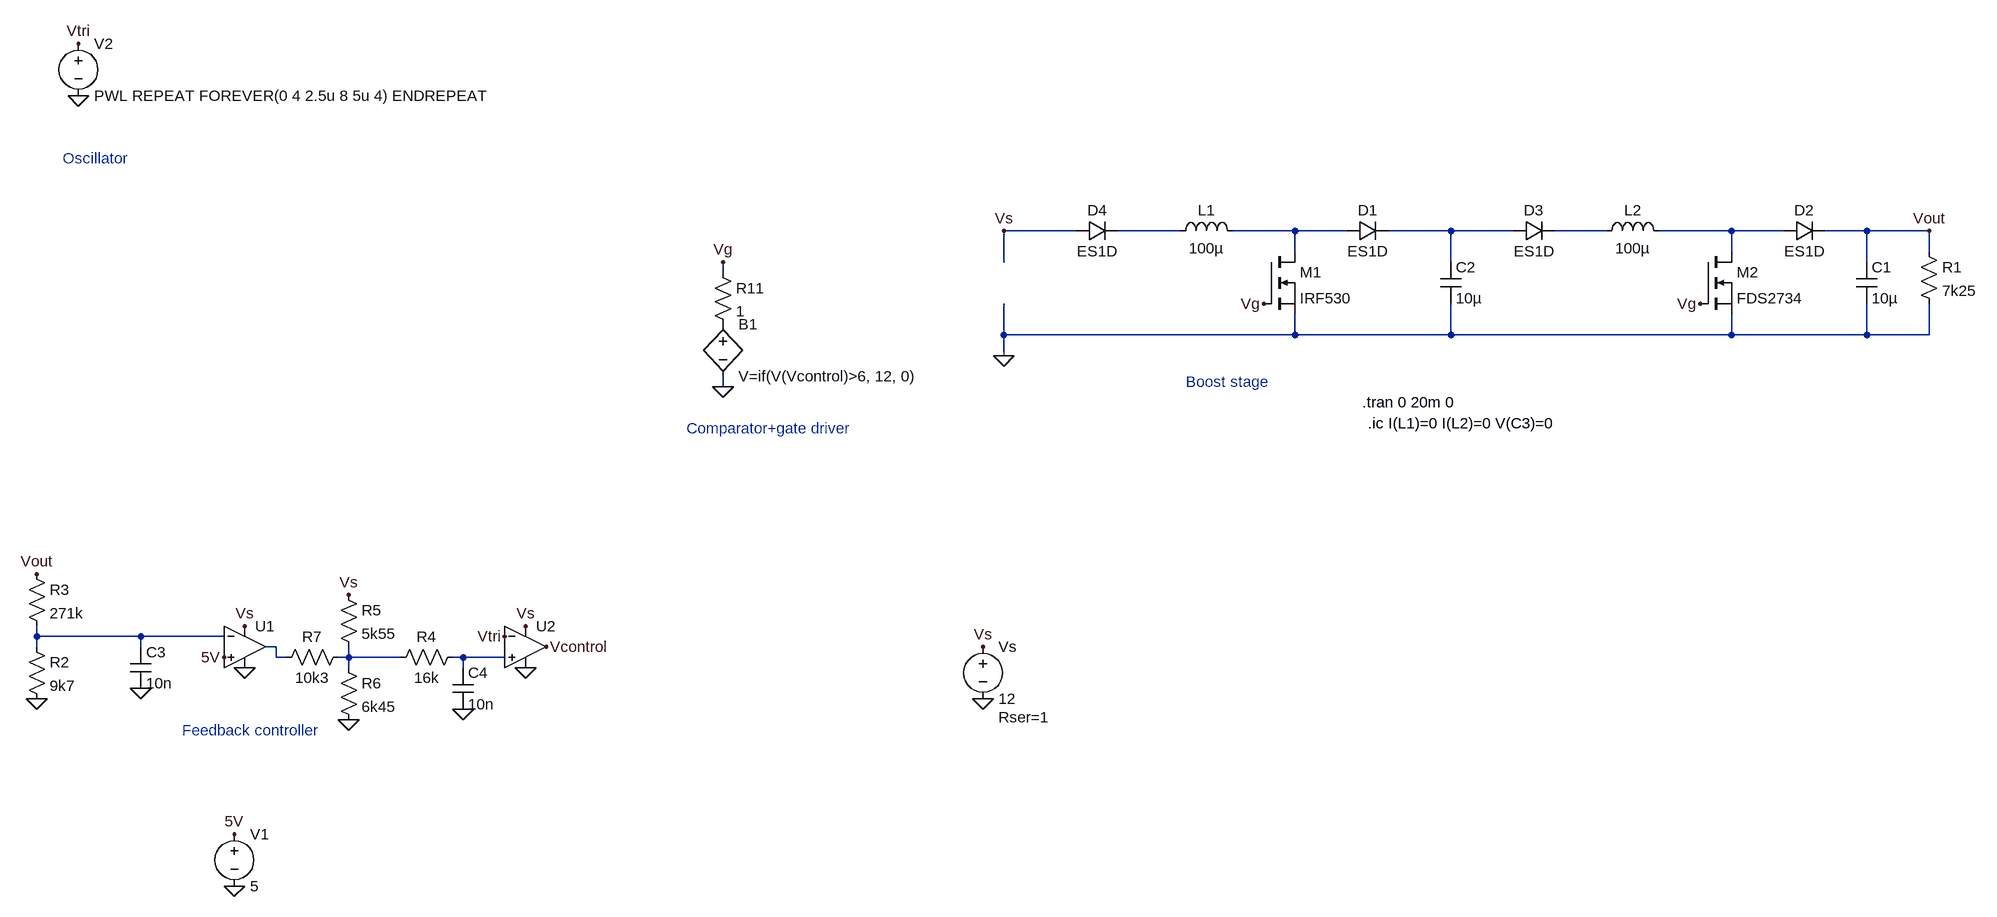
[diagram p0: schematic 2_stage_boost_converter.asc]
2_stage_boost_converter.asc, the LTspice schematic file:
Version 4
SHEET 1 1648 1172
WIRE 256 144 144 144
WIRE 416 144 320 144
WIRE 592 144 496 144
WIRE 672 144 592 144
WIRE 832 144 736 144
WIRE 928 144 832 144
WIRE 1072 144 992 144
WIRE 1264 144 1152 144
WIRE 1344 144 1264 144
WIRE 1472 144 1408 144
WIRE 1568 144 1472 144
WIRE 592 176 592 144
WIRE 1264 176 1264 144
WIRE 1568 176 1568 144
WIRE 144 192 144 144
WIRE 832 192 832 144
WIRE 1472 192 1472 144
WIRE -288 208 -288 192
WIRE 144 304 144 256
WIRE 592 304 592 272
WIRE 592 304 144 304
WIRE 832 304 832 256
WIRE 832 304 592 304
WIRE 1264 304 1264 272
WIRE 1264 304 832 304
WIRE 1472 304 1472 256
WIRE 1472 304 1264 304
WIRE 1568 304 1568 256
WIRE 1568 304 1472 304
WIRE 144 336 144 304
WIRE -288 384 -288 368
WIRE -1344 768 -1344 752
WIRE -1184 768 -1344 768
WIRE -1056 768 -1184 768
WIRE -1344 784 -1344 768
WIRE -1184 784 -1184 768
WIRE -976 784 -992 784
WIRE -976 800 -976 784
WIRE -960 800 -976 800
WIRE -864 800 -864 784
WIRE -864 800 -880 800
WIRE -784 800 -864 800
WIRE -688 800 -704 800
WIRE -624 800 -688 800
WIRE -864 816 -864 800
WIRE -688 816 -688 800
FLAG 112 864 0
FLAG 112 784 Vs
FLAG 1568 144 Vout
FLAG 144 144 Vs
FLAG 144 336 0
FLAG -1024 752 Vs
FLAG -1024 816 0
FLAG -288 192 Vg
FLAG 544 256 Vg
FLAG -288 384 0
FLAG -1280 -64 0
FLAG -1280 -144 Vtri
FLAG -1344 864 0
FLAG -1344 672 Vout
FLAG -1040 1072 5V
FLAG -1040 1152 0
FLAG -1056 800 5V
FLAG -624 768 Vtri
FLAG -864 896 0
FLAG -864 704 Vs
FLAG -592 816 0
FLAG -592 752 Vs
FLAG 1216 256 Vg
FLAG -560 784 Vcontrol
FLAG -1184 848 0
FLAG -688 880 0
SYMBOL ind 400 160 R270
WINDOW 0 32 56 VTop 2
WINDOW 3 5 56 VBottom 2
SYMATTR InstName L1
SYMATTR Value 100µ
SYMBOL nmos 544 176 R0
SYMATTR InstName M1
SYMATTR Value IRF530
SYMBOL diode 672 160 R270
WINDOW 0 32 32 VTop 2
WINDOW 3 0 32 VBottom 2
SYMATTR InstName D1
SYMATTR Value ES1D
SYMBOL cap 816 192 R0
SYMATTR InstName C2
SYMATTR Value 10µ
SYMBOL voltage 112 768 R0
WINDOW 123 0 0 Left 0
WINDOW 39 24 124 Left 2
SYMATTR SpiceLine Rser=1
SYMATTR InstName Vs
SYMATTR Value 12
SYMBOL res 1552 160 R0
SYMATTR InstName R1
SYMATTR Value 7k25
SYMBOL bv -288 272 R0
SYMATTR InstName B1
SYMATTR Value V=if(V(Vcontrol)>6, 12, 0)
SYMBOL res -304 192 R0
SYMATTR InstName R11
SYMATTR Value 1
SYMBOL voltage -1280 -160 R0
WINDOW 123 0 0 Left 0
WINDOW 39 0 0 Left 0
SYMATTR InstName V2
SYMATTR Value PWL REPEAT FOREVER(0 4 2.5u 8 5u 4) ENDREPEAT
SYMBOL voltage -1040 1056 R0
SYMATTR InstName V1
SYMATTR Value 5
SYMBOL res -880 688 R0
SYMATTR InstName R5
SYMATTR Value 5k55
SYMBOL res -880 800 R0
SYMATTR InstName R6
SYMATTR Value 6k45
SYMBOL res -864 784 R90
WINDOW 0 0 56 VBottom 2
WINDOW 3 32 56 VTop 2
SYMATTR InstName R7
SYMATTR Value 10k3
SYMBOL res -1360 768 R0
SYMATTR InstName R2
SYMATTR Value 9k7
SYMBOL res -1360 656 R0
SYMATTR InstName R3
SYMATTR Value 271k
SYMBOL ind 1056 160 R270
WINDOW 0 32 56 VTop 2
WINDOW 3 5 56 VBottom 2
SYMATTR InstName L2
SYMATTR Value 100µ
SYMBOL nmos 1216 176 R0
SYMATTR InstName M2
SYMATTR Value FDS2734
SYMBOL cap 1456 192 R0
SYMATTR InstName C1
SYMATTR Value 10µ
SYMBOL OpAmps\\UniversalOpAmp2 -1024 784 R0
SYMATTR InstName U1
SYMATTR Value2 Avol=1Meg GBW=1G Slew=1G
SYMBOL OpAmps\\UniversalOpAmp2 -592 784 R0
SYMATTR InstName U2
SYMATTR Value2 Avol=1Meg GBW=1G Slew=1G
SYMBOL cap -1200 784 R0
SYMATTR InstName C3
SYMATTR Value 10n
SYMBOL diode 1344 160 R270
WINDOW 0 32 32 VTop 2
WINDOW 3 0 32 VBottom 2
SYMATTR InstName D2
SYMATTR Value ES1D
SYMBOL diode 928 160 R270
WINDOW 0 32 32 VTop 2
WINDOW 3 0 32 VBottom 2
SYMATTR InstName D3
SYMATTR Value ES1D
SYMBOL diode 256 160 R270
WINDOW 0 32 32 VTop 2
WINDOW 3 0 32 VBottom 2
SYMATTR InstName D4
SYMATTR Value ES1D
SYMBOL cap -704 816 R0
SYMATTR InstName C4
SYMATTR Value 10n
SYMBOL res -688 784 R90
WINDOW 0 0 56 VBottom 2
WINDOW 3 32 56 VTop 2
SYMATTR InstName R4
SYMATTR Value 16k
TEXT 696 408 Left 2 !.tran 0 20m 0
TEXT -344 448 Left 2 ;Comparator+gate driver
TEXT 424 376 Left 2 ;Boost stage
TEXT -1120 912 Left 2 ;Feedback controller
TEXT -1304 32 Left 2 ;Oscillator
TEXT 704 440 Left 2 !.ic I(L1)=0 I(L2)=0 V(C3)=0

The netlist it stands for:
* 2_stage_boost_converter.asc
L1 N001 N002 100µ
M1 N002 Vg 0 0 IRF530
D1 N002 N003 ES1D
C2 N003 0 10µ
Vs Vs 0 12 Rser=1
R1 Vout 0 7k25
B1 P001 0 V=if(V(Vcontrol)>6, 12, 0)
R11 Vg P001 1
V2 Vtri 0 PWL REPEAT FOREVER(0 4 2.5u 8 5u 4) ENDREPEAT
V1 5V 0 5
R5 Vs N008 5k55
R6 N008 0 6k45
R7 N008 N007 10k3
R2 N006 0 9k7
R3 Vout N006 271k
L2 N004 N005 100µ
M2 N005 Vg 0 0 FDS2734
C1 Vout 0 10µ
XU1 5V N006 Vs 0 N007 level2 Avol=1Meg GBW=1G Slew=1G Ilimit=25m Rail=0 Vos=0 En=0 Enk=0 In=0 Ink=0 Rin=500Meg  ; pins In+ In- V+ V- OUT
XU2 N009 Vtri Vs 0 Vcontrol level2 Avol=1Meg GBW=1G Slew=1G Ilimit=25m Rail=0 Vos=0 En=0 Enk=0 In=0 Ink=0 Rin=500Meg  ; pins In+ In- V+ V- OUT
C3 N006 0 10n
D2 N005 Vout ES1D
D3 N003 N004 ES1D
D4 Vs N001 ES1D
C4 N009 0 10n
R4 N009 N008 16k
.model D D
.lib standard.dio
.model NMOS NMOS
.model PMOS PMOS
.lib standard.mos
.tran 0 20m 0
* Comparator+gate driver
* Boost stage
* Feedback controller
* Oscillator
.ic I(L1)=0 I(L2)=0 V(C3)=0
.lib UniversalOpAmp2.lib
.backanno
.end